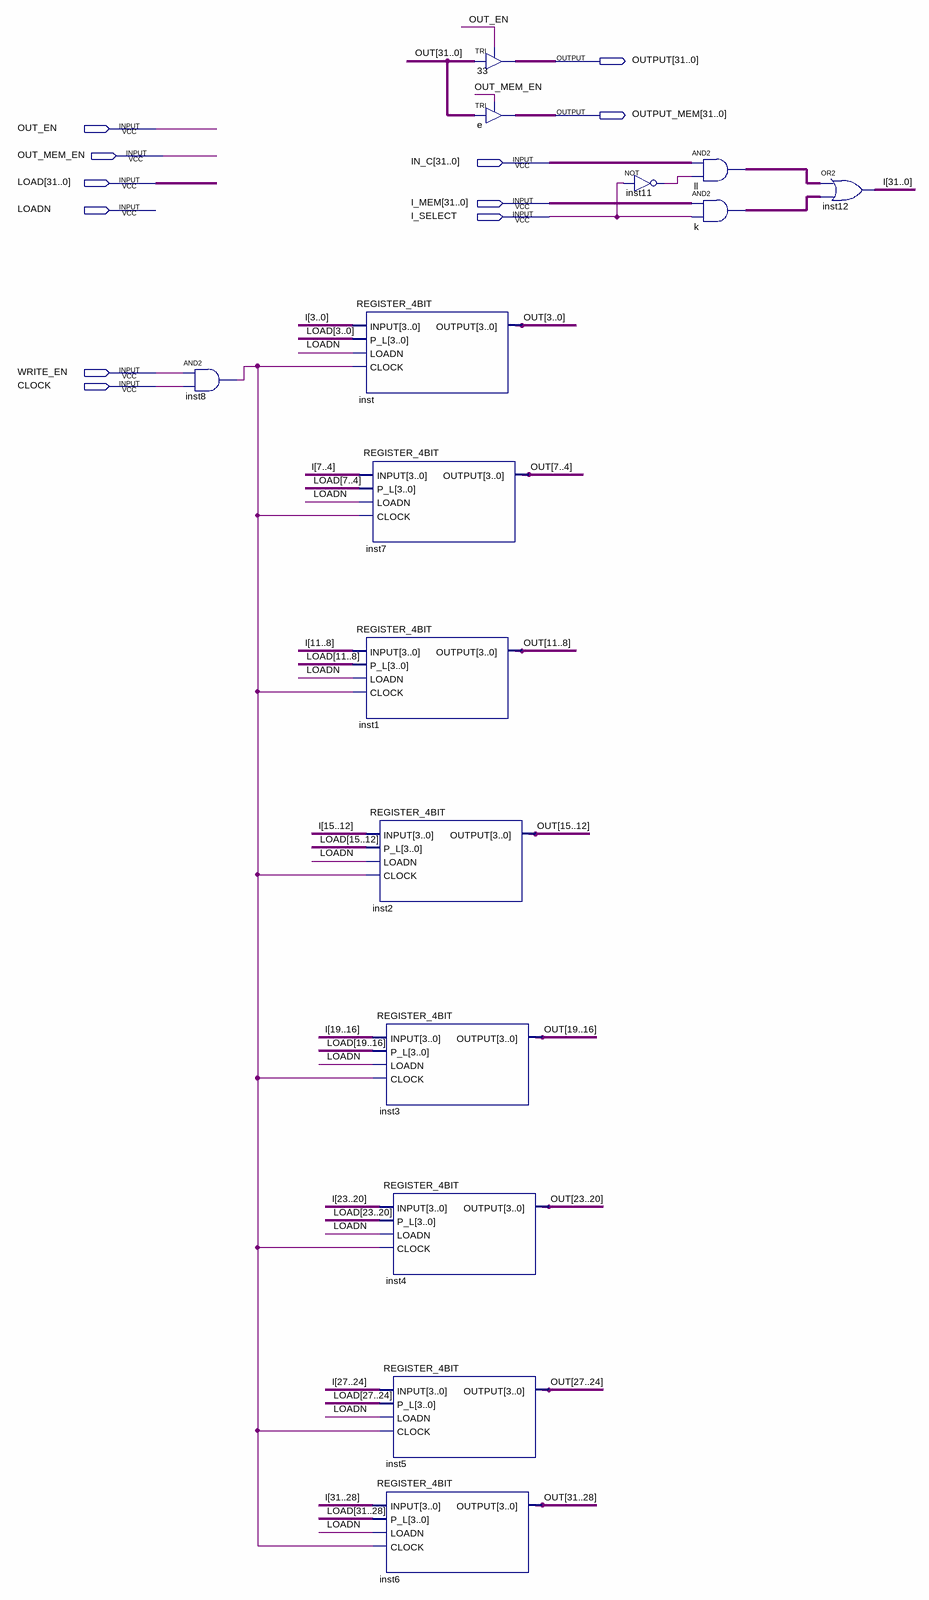
[diagram p0: schematic sheet]
// Quartus schematic REGISTER_32BIT_INCOMPLETO.bdf as structural Verilog: 15 symbols, 11 pins
module REGISTER_32BIT_INCOMPLETO (
  input  OUT_EN,
  input  OUT_MEM_EN,
  input  [31:0] IN_C,
  input  [31:0] LOAD,
  input  [31:0] I_MEM,
  input  LOADN,
  input  I_SELECT,
  input  WRITE_EN,
  input  CLOCK,
  output [31:0] OUTPUT,
  output [31:0] OUTPUT_MEM
);

  wire inst8_out, inst11_out;
  wire [31:0] I, k_out, ll_out, OUT;

  and inst8 (inst8_out, WRITE_EN, CLOCK);
  REGISTER_4BIT inst (.INPUT(I[3:0]), .P_L(LOAD[3:0]), .LOADN(LOADN), .CLOCK(inst8_out), .OUTPUT(OUT[3:0]));
  REGISTER_4BIT inst7 (.INPUT(I[7:4]), .P_L(LOAD[7:4]), .LOADN(LOADN), .CLOCK(inst8_out), .OUTPUT(OUT[7:4]));
  REGISTER_4BIT inst1 (.INPUT(I[11:8]), .P_L(LOAD[11:8]), .LOADN(LOADN), .CLOCK(inst8_out), .OUTPUT(OUT[11:8]));
  REGISTER_4BIT inst2 (.INPUT(I[15:12]), .P_L(LOAD[15:12]), .LOADN(LOADN), .CLOCK(inst8_out), .OUTPUT(OUT[15:12]));
  REGISTER_4BIT inst3 (.INPUT(I[19:16]), .P_L(LOAD[19:16]), .LOADN(LOADN), .CLOCK(inst8_out), .OUTPUT(OUT[19:16]));
  REGISTER_4BIT inst4 (.INPUT(I[23:20]), .P_L(LOAD[23:20]), .LOADN(LOADN), .CLOCK(inst8_out), .OUTPUT(OUT[23:20]));
  REGISTER_4BIT inst5 (.INPUT(I[27:24]), .P_L(LOAD[27:24]), .LOADN(LOADN), .CLOCK(inst8_out), .OUTPUT(OUT[27:24]));
  REGISTER_4BIT inst6 (.INPUT(I[31:28]), .P_L(LOAD[31:28]), .LOADN(LOADN), .CLOCK(inst8_out), .OUTPUT(OUT[31:28]));
  TRI u_33[31:0] (.IN(OUT), .OE(OUT_EN), .OUT(OUTPUT));
  TRI e[31:0] (.IN(OUT), .OE(OUT_MEM_EN), .OUT(OUTPUT_MEM));
  not inst11 (inst11_out, I_SELECT);
  assign ll_out = IN_C & {32{inst11_out}};  // AND2 ll, 32 bits wide
  assign k_out = I_MEM & {32{I_SELECT}};  // AND2 k, 32 bits wide
  assign I = ll_out | k_out;  // OR2 inst12, 32 bits wide
endmodule
